# EAGLE design main (EAGLE 7.2.0)
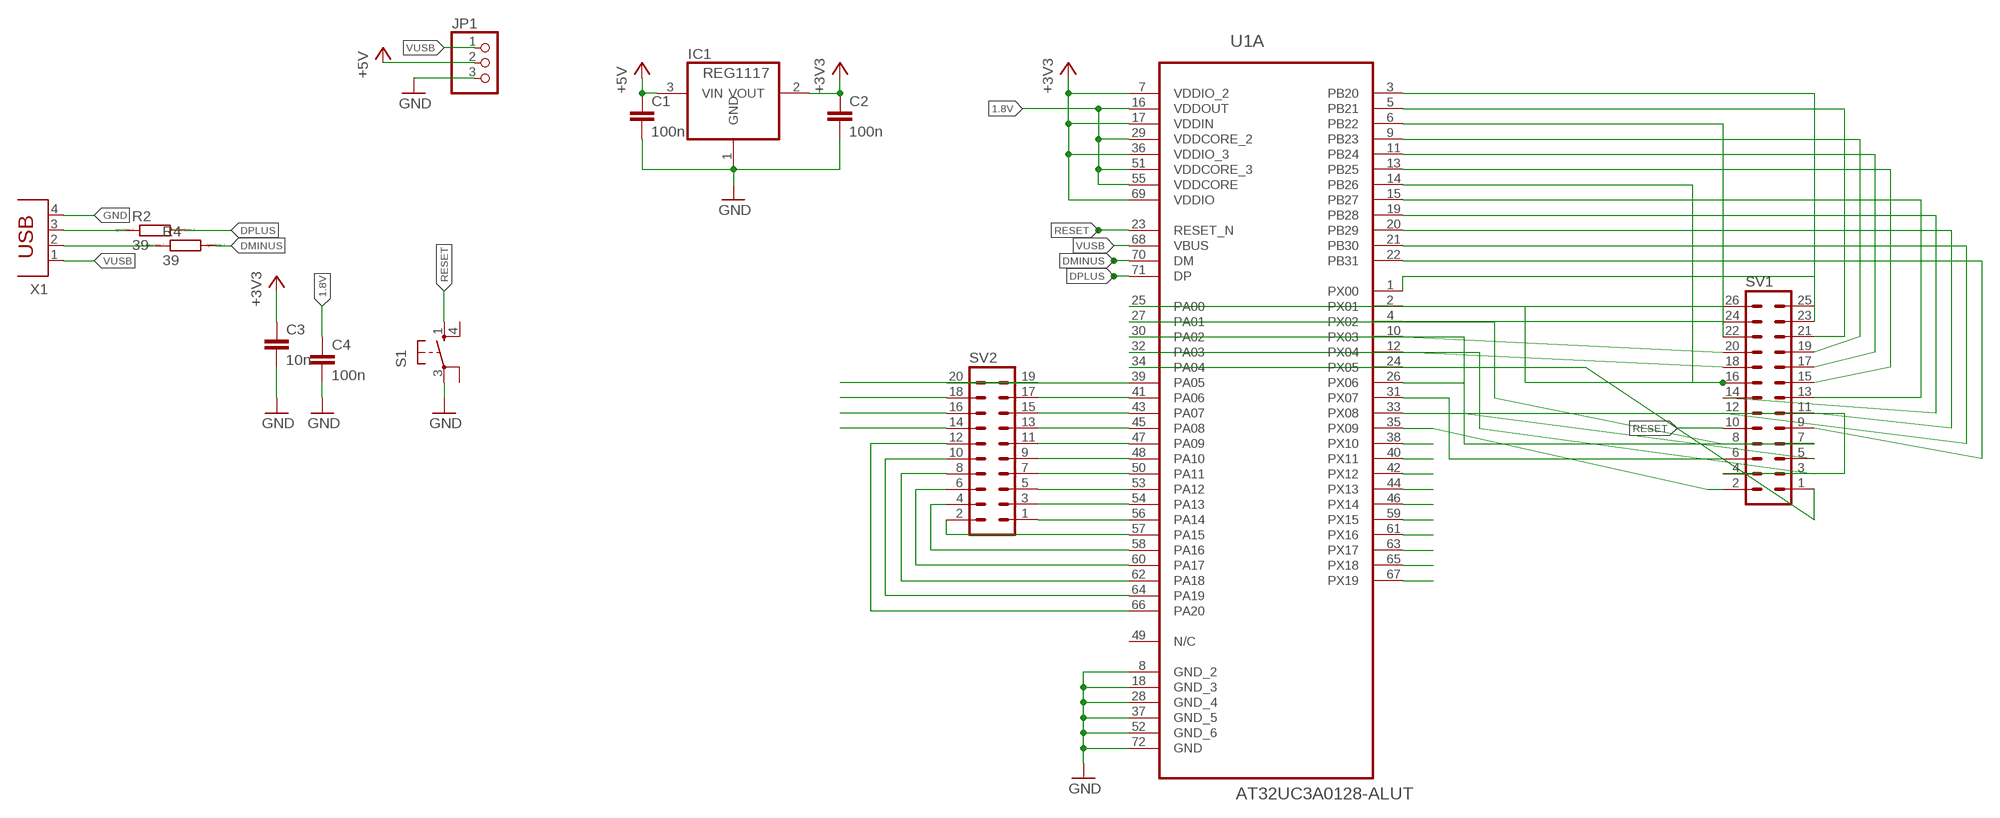
[diagram p0: schematic, sheet 1]

## Parts
C1  100n  C-EU050-025X075  [C050-025X075]
C2  100n  C-EU050-025X075  [C050-025X075]
C3  10n  C-EU050-025X075  [C050-025X075]
C4  100n  C-EU050-025X075  [C050-025X075]
IC1  REG1117  [SOT223]
JP1  PINHD-1X3  [1X03]
R2  39  R0207/10  [0207/10]
R4  39  R0207/10  [0207/10]
S1  10-XX  [B3F-10XX]
SV1  MA13-2  [MA13-2]
SV2  MA10-2  [MA10-2]
U1  AT32UC3A0128-ALUT  [QFP50P2200X2200X160-144N]
X1  PN61729  [PN61729]

## Nets
1.8V: C4.1 U1.16(A:VDDOUT) U1.29(A:VDDCORE_2) U1.51(A:VDDCORE_3) U1.55(A:VDDCORE)
+3V3: C2.1 C3.1 IC1.2(VOUT) U1.7(A:VDDIO_2) U1.17(A:VDDIN) U1.36(A:VDDIO_3) U1.69(A:VDDIO)
+5V: C1.1 IC1.3(VIN) JP1.2
B$1: SV2.14 SV2.16 SV2.18 SV2.19 U1.38(A:PX10) U1.40(A:PX11) U1.42(A:PX12) U1.44(A:PX13) U1.46(A:PX14) U1.59(A:PX15) U1.61(A:PX16) U1.63(A:PX17) U1.65(A:PX18) U1.67(A:PX19)
DMINUS: R4.2 U1.70(A:DM)
DPLUS: R2.2 U1.71(A:DP)
GND: C1.2 C2.2 C3.2 C4.2 IC1.1(GND) JP1.3 S1.3(P) U1.8(A:GND_2) U1.18(A:GND_3) U1.28(A:GND_4) U1.37(A:GND_5) U1.52(A:GND_6) U1.72(A:GND) X1.4
N$1: SV1.25 U1.1(A:PX00)
N$2: SV1.26 U1.2(A:PX01)
N$3: SV1.23 U1.3(A:PB20)
N$4: SV1.21 U1.5(A:PB21)
N$5: SV1.24 U1.4(A:PX02)
N$6: SV1.20 U1.10(A:PX03)
N$7: SV1.22 U1.6(A:PB22)
N$8: SV1.19 U1.9(A:PB23)
N$9: SV1.17 U1.11(A:PB24)
N$10: SV1.18 U1.12(A:PX04)
N$11: SV1.15 U1.13(A:PB25)
N$12: SV1.16 U1.14(A:PB26) U1.25(A:PA00)
N$13: SV1.13 U1.15(A:PB27)
N$14: SV1.14 U1.19(A:PB28)
N$15: SV1.11 U1.20(A:PB29)
N$16: SV1.12 U1.21(A:PB30)
N$17: SV1.9 U1.22(A:PB31)
N$18: SV1.7 U1.26(A:PX06)
N$19: SV1.8 U1.27(A:PA01)
N$20: SV1.5 U1.30(A:PA02)
N$21: SV1.3 U1.32(A:PA03)
N$22: SV1.1 U1.34(A:PA04)
N$23: SV1.6 U1.31(A:PX07)
N$24: SV1.4 U1.33(A:PX08)
N$25: SV1.2 U1.35(A:PX09)
N$26: R2.1 X1.3
N$27: SV2.12 U1.66(A:PA20)
N$28: R4.1 X1.2
N$29: SV2.10 U1.64(A:PA19)
N$30: SV2.8 U1.62(A:PA18)
N$31: SV2.6 U1.60(A:PA17)
N$32: SV2.4 U1.58(A:PA16)
N$33: SV2.2 U1.57(A:PA15)
N$34: SV2.1 U1.56(A:PA14)
N$35: SV2.3 U1.54(A:PA13)
N$36: SV2.5 U1.53(A:PA12)
N$37: SV2.7 U1.50(A:PA11)
N$38: SV2.9 U1.48(A:PA10)
N$39: SV2.11 U1.47(A:PA09)
N$40: SV2.13 U1.45(A:PA08)
N$41: SV2.15 U1.43(A:PA07)
N$42: SV2.17 U1.41(A:PA06)
N$43: SV2.20 U1.39(A:PA05)
RESET: S1.1(S) SV1.10 U1.23(A:RESET_N)
VUSB: JP1.1 U1.68(A:VBUS) X1.1
Unconnected: S1.2(P1) S1.4(S1) U1.24(A:PX05) U1.49(A:N/C) U1.73(B:PA21) U1.74(B:PA22) U1.75(B:PA23) U1.76(B:PA24) U1.77(B:PA25) U1.78(B:PA26) U1.79(B:PA27) U1.80(B:PA28) U1.82(B:ADVREF) U1.83(B:GNDANA) U1.85(B:PC00) U1.86(B:PC01) U1.87(B:PX20) U1.88(B:PB00) U1.89(B:PX21) U1.90(B:PB01) U1.91(B:PX22) U1.94(B:GND_2) U1.95(B:PX23) U1.96(B:PB02) U1.97(B:PX24) U1.98(B:PB03) U1.99(B:PX25) U1.100(B:PB04) U1.101(B:PX26) U1.102(B:PB05) U1.103(B:PX27) U1.104(B:PB06) U1.105(B:PX28) U1.106(B:PB07) U1.107(B:PX29) U1.109(B:GND_3) U1.110(B:PX30) U1.111(B:PB08) U1.112(B:PX31) U1.113(B:PB09) U1.114(B:PX32) U1.115(B:PB10) U1.117(B:GND) U1.118(B:PX33) U1.119(B:PB11) U1.120(B:PX34) U1.121(B:PB12) U1.122(B:PA29) U1.123(B:PA30) U1.124(B:PC02) U1.125(B:PC03) U1.126(B:PB13) U1.127(B:PB14) U1.128(B:TMS) U1.129(B:TCK) U1.130(B:TDO) U1.131(B:TDI) U1.132(B:PC04) U1.133(B:PC05) U1.134(B:PB15) U1.135(B:PX35) U1.136(B:PB16) U1.137(B:PX36) U1.139(B:PB17) U1.140(B:PX37) U1.141(B:PB18) U1.142(B:PX38) U1.143(B:PB19) U1.144(B:PX39)

## Power pins joined to a net without a drawn wire
VDDANA: U1.81(B:VDDANA)
VDDCORE: U1.138(B:VDDCORE)
VDDIO: U1.116(B:VDDIO)
VDDIO_2: U1.92(B:VDDIO_2)
VDDIO_3: U1.93(B:VDDIO_3)
VDDIO_4: U1.108(B:VDDIO_4)
VDDPLL: U1.84(B:VDDPLL)

## Library data of the parts
C1-C4 = rcl:C-EU: CAPACITOR, European symbol
IC1 = burr-brown:REG1117: 800mA and 1A Low Dropout (LDO) Positive Regulator 1.8V, 2.5V, 2.85V, 3.3V, 5V, and Adj; MPN: REG1117; OC_FARNELL: 1097566; OC_NEWARK: 14P6981
JP1 = pinhead:PINHD-1X3: PIN HEADER
R2 R4 = eagle-ltspice:R: RESISTOR, European symbol; SPICEMODEL: NONE; SPICEPREFIX: R
S1 = switch-omron:10-XX: OMRON SWITCH; MPN: B3F-1000; OC_FARNELL: 176432; OC_NEWARK: 36M3542
SV1 = con-lstb:MA13-2: PIN HEADER; OC_FARNELL: unknown; OC_NEWARK: unknown
SV2 = con-lstb:MA10-2: PIN HEADER; OC_FARNELL: unknown; OC_NEWARK: unknown
U1 = Atmel_By_element14_Batch_1-00:AT32UC3A0128-ALUT: 32-Bit Microcontroller; DESCRIPTION: 32-Bit Microcontroller; MPN: AT32UC3A0128-ALUT; OC_FARNELL: 1841633; OC_NEWARK: 12T1368; PACKAGE: LQFP-144; SUPPLIER: Atmel Corporation
X1 = con-berg:PN61729: BERG USB connector; OC_FARNELL: unknown; OC_NEWARK: unknown

## Board
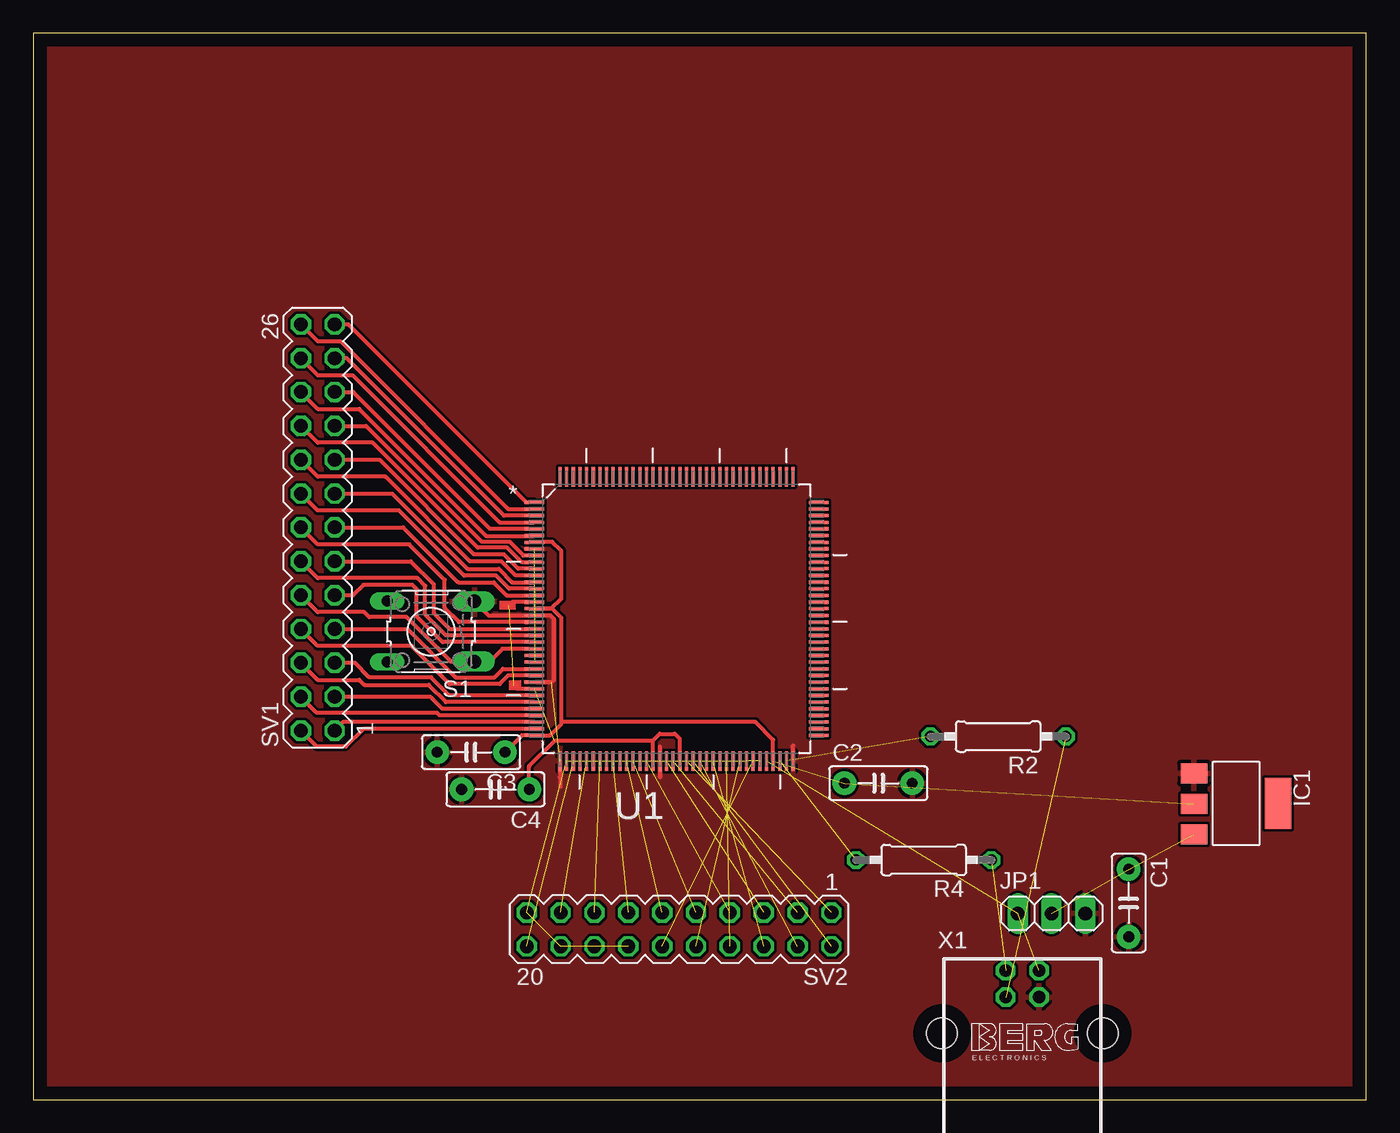
[diagram p1: board, top side]

Size 100 x 80 mm. Coordinates in mm from the lower left corner, seen from the top.
Outline: 0,0 100,0 100,80 0,80 0,0
Copper layers (1*16): Top 0.035mm / dielectric 1.5mm / Bottom 0.035mm
Design rules "default": minimum track width 10mil, minimum drill 24mil, track to track 8mil, track to pad 8mil, pad to pad 8mil, via to via 8mil, smd to smd 8mil, copper to edge 40mil, drill to drill 8mil, minimum pad ring 10mil, minimum via ring 8mil, stop-mask expansion 4mil, vias tented up to drill 0mil, thermal gap 10mil

### Footprints (pad centres in the part's own frame; a part is rotated, then mirrored left to right if it is on the bottom)
C050-025X075 = drill 0.813 pad 1.778: 1 -2.54,0; 2 2.54,0
SOT223 = smd 1.499 x 2.007: 1 -2.261,-3.15; 2 0.025,-3.15; 3 2.311,-3.15 | smd 3.81 x 2.007: 4 0,3.15
1X03 = drill 1.016 long: 1 -2.54,0; 2 0,0; 3 2.54,0
0207/10 = drill 0.813 octagon: 1 -5.08,0; 2 5.08,0
B3F-10XX = drill 1.016 long: 1 -3.251,2.261; 3 -3.251,-2.261 | drill 0.8 pad 0.254 long: 2 3.302,2.286; 4 3.302,-2.286
MA13-2 = drill 1.016 octagon: 1 -15.24,-1.27; 2 -15.24,1.27; 3 -12.7,-1.27; 4 -12.7,1.27; 5 -10.16,-1.27; 6 -10.16,1.27; 7 -7.62,-1.27; 8 -7.62,1.27; 9 -5.08,-1.27; 10 -5.08,1.27; 11 -2.54,-1.27; 12 -2.54,1.27; 13 0,-1.27; 14 0,1.27; 15 2.54,-1.27; 16 2.54,1.27; 17 5.08,-1.27; 18 5.08,1.27; 19 7.62,-1.27; 20 7.62,1.27; 21 10.16,-1.27; 22 10.16,1.27; 23 12.7,-1.27; 24 12.7,1.27; 25 15.24,-1.27; 26 15.24,1.27
MA10-2 = drill 1.016 octagon: 1 -11.43,-1.27; 2 -11.43,1.27; 3 -8.89,-1.27; 4 -8.89,1.27; 5 -6.35,-1.27; 6 -6.35,1.27; 7 -3.81,-1.27; 8 -3.81,1.27; 9 -1.27,-1.27; 10 -1.27,1.27; 11 1.27,-1.27; 12 1.27,1.27; 13 3.81,-1.27; 14 3.81,1.27; 15 6.35,-1.27; 16 6.35,1.27; 17 8.89,-1.27; 18 8.89,1.27; 19 11.43,-1.27; 20 11.43,1.27
QFP50P2200X2200X160-144N = smd 1.473 x 0.229: 1 -10.668,8.738; 2 -10.668,8.255; 3 -10.668,7.747; 4 -10.668,7.239; 5 -10.668,6.756; 6 -10.668,6.248; 7 -10.668,5.74; 8 -10.668,5.258; 9 -10.668,4.75; 10 -10.668,4.242; 11 -10.668,3.759; 12 -10.668,3.251; 13 -10.668,2.743; 14 -10.668,2.261; 15 -10.668,1.753; 16 -10.668,1.245; 17 -10.668,0.762; 18 -10.668,0.254; 19 -10.668,-0.254; 20 -10.668,-0.762; 21 -10.668,-1.245; 22 -10.668,-1.753; 23 -10.668,-2.261; 24 -10.668,-2.743; 25 -10.668,-3.251; 26 -10.668,-3.759; 27 -10.668,-4.242; 28 -10.668,-4.75; 29 -10.668,-5.258; 30 -10.668,-5.74; 31 -10.668,-6.248; 32 -10.668,-6.756; 33 -10.668,-7.239; 34 -10.668,-7.747; 35 -10.668,-8.255; 36 -10.668,-8.738; 73 10.668,-8.738; 74 10.668,-8.255; 75 10.668,-7.747; 76 10.668,-7.239; 77 10.668,-6.756; 78 10.668,-6.248; 79 10.668,-5.74; 80 10.668,-5.258; 81 10.668,-4.75; 82 10.668,-4.242; 83 10.668,-3.759; 84 10.668,-3.251; 85 10.668,-2.743; 86 10.668,-2.261; 87 10.668,-1.753; 88 10.668,-1.245; 89 10.668,-0.762; 90 10.668,-0.254; 91 10.668,0.254; 92 10.668,0.762; 93 10.668,1.245; 94 10.668,1.753; 95 10.668,2.261; 96 10.668,2.743; 97 10.668,3.251; 98 10.668,3.759; 99 10.668,4.242; 100 10.668,4.75; 101 10.668,5.258; 102 10.668,5.74; 103 10.668,6.248; 104 10.668,6.756; 105 10.668,7.239; 106 10.668,7.747; 107 10.668,8.255; 108 10.668,8.738 | smd 0.229 x 1.473: 37 -8.738,-10.668; 38 -8.255,-10.668; 39 -7.747,-10.668; 40 -7.239,-10.668; 41 -6.756,-10.668; 42 -6.248,-10.668; 43 -5.74,-10.668; 44 -5.258,-10.668; 45 -4.75,-10.668; 46 -4.242,-10.668; 47 -3.759,-10.668; 48 -3.251,-10.668; 49 -2.743,-10.668; 50 -2.261,-10.668; 51 -1.753,-10.668; 52 -1.245,-10.668; 53 -0.762,-10.668; 54 -0.254,-10.668; 55 0.254,-10.668; 56 0.762,-10.668; 57 1.245,-10.668; 58 1.753,-10.668; 59 2.261,-10.668; 60 2.743,-10.668; 61 3.251,-10.668; 62 3.759,-10.668; 63 4.242,-10.668; 64 4.75,-10.668; 65 5.258,-10.668; 66 5.74,-10.668; 67 6.248,-10.668; 68 6.756,-10.668; 69 7.239,-10.668; 70 7.747,-10.668; 71 8.255,-10.668; 72 8.738,-10.668; 109 8.738,10.668; 110 8.255,10.668; 111 7.747,10.668; 112 7.239,10.668; 113 6.756,10.668; 114 6.248,10.668; 115 5.74,10.668; 116 5.258,10.668; 117 4.75,10.668; 118 4.242,10.668; 119 3.759,10.668; 120 3.251,10.668; 121 2.743,10.668; 122 2.261,10.668; 123 1.753,10.668; 124 1.245,10.668; 125 0.762,10.668; 126 0.254,10.668; 127 -0.254,10.668; 128 -0.762,10.668; 129 -1.245,10.668; 130 -1.753,10.668; 131 -2.261,10.668; 132 -2.743,10.668; 133 -3.251,10.668; 134 -3.759,10.668; 135 -4.242,10.668; 136 -4.75,10.668; 137 -5.258,10.668; 138 -5.74,10.668; 139 -6.248,10.668; 140 -6.756,10.668; 141 -7.239,10.668; 142 -7.747,10.668; 143 -8.255,10.668; 144 -8.738,10.668
PN61729 = drill 0.95 octagon: 1 1.25,4.71; 2 -1.25,4.71; 3 -1.25,2.71; 4 1.25,2.71 | hole 2.3: -6.02,0; 6.02,0

### Placement (x,y rotation side)
C1  82.18,14.74 270 top
C2  63.4,23.74 0 top
C3  32.84,26.06 180 top
C4  34.67,23.27 180 top
IC1  90.23,22.21 270 top
JP1  76.39,13.96 0 top
R2  72.39,27.24 180 top
R4  66.8,17.97 180 top
S1  29.84,35.12 180 top
SV1  21.34,42.93 90 top
SV2  48.45,12.76 180 top
U1  48.26,36.07 0 top
X1  74.21,4.97 0 top

### Tracks (layer width: path | path; a pad name or v marks a point on that pad's centre or on a via)
1.8V  (2 unrouted)
  Top 0.305: U1.51 46.51,26.95 | U1.55 48.51,27.05 48.13,27.43 46.99,27.43 46.51,26.95 | U1.16 35.92,37.31 35.69,37.08 | U1.29 36.31,30.81 36.07,31.05 | 46.51,26.95 46.48,26.92 39.12,26.92 37.21,25.02 C4.1
+3V3  (2 unrouted)
  Top 0.305: U1.69 55.5,26.99 54.17,28.32 39.62,28.32 | U1.7 37.63,41.85 38.92,41.85 39.62,41.15 39.62,37.59 38.86,36.83 U1.17 38.92,36.83 39.62,36.13 39.62,28.32 | 39.62,28.32 39.62,28.19 38.76,27.33 U1.36 36.65,27.33 C3.1
+5V  (2 unrouted)
B$1  (13 unrouted)
DMINUS  (1 unrouted)
DPLUS  (1 unrouted)
GND  (2 unrouted)
  Top 0.305: 39.52,23.47 U1.37 39.52,24.22 39.5,24.19 | 47.02,26.49 U1.52 47.02,24.23 47.05,24.19 | U1.72 57,26.57 | U1.28 38.88,31.32 39.05,31.5 39.05,36.07 38.8,36.32 U1.18 34.15,36.32 S1.3
  pour Top: 0,80.01 100.33,80.01 100.33,0 0,0
N$1
  Top 0.305: U1.1 37.57,44.83 36.96,44.83 23.62,58.17 SV1.25
N$2
  Top 0.305: U1.2 35.62,44.32 23.05,56.9 21.34,56.9 SV1.26
N$3
  Top 0.305: U1.3 35.31,43.81 23.5,55.63 SV1.23
N$4
  Top 0.305: U1.5 34.27,42.82 24,53.09 SV1.21
N$5
  Top 0.305: U1.4 34.99,43.31 23.94,54.36 21.34,54.36 SV1.24
N$6
  Top 0.305: U1.10 36.65,40.31 35.56,41.4 33.34,41.4 25.46,49.28 21.34,49.28 SV1.20
N$7
  Top 0.305: U1.6 37.57,42.29 33.97,42.29 24.45,51.82 21.34,51.82 SV1.22
N$8
  Top 0.305: U1.9 36.78,40.82 35.75,41.85 33.66,41.85 24.96,50.55 SV1.19
N$9
  Top 0.305: U1.11 36.37,39.83 35.31,40.89 33.08,40.89 25.97,48.01 SV1.17
N$10
  Top 0.305: U1.12 36.18,39.32 35.12,40.39 32.77,40.39 26.42,46.74 21.34,46.74 SV1.18
N$11
  Top 0.305: U1.13 35.93,38.81 34.92,39.81 32.58,39.81 26.92,45.47 SV1.15
N$12  (1 unrouted)
  Top 0.305: U1.14 35.71,38.33 34.73,39.31 32.32,39.31 27.43,44.2 21.34,44.2 SV1.16 | 37.6,32.83 U1.25
N$13
  Top 0.305: U1.15 35.52,37.82 34.54,38.8 31.88,38.8 27.75,42.93 SV1.13
N$14
  Top 0.305: U1.19 31.94,35.81 30.86,36.89 30.86,38.99 28.19,41.66 21.34,41.66 SV1.14
N$15
  Top 0.305: U1.20 31.24,35.31 30.04,36.51 30.04,38.67 28.32,40.39 SV1.11
N$16
  Top 0.305: U1.21 30.96,34.82 29.4,36.39 29.4,38.54 28.83,39.12 21.34,39.12 SV1.12
N$17
  Top 0.305: U1.22 30.71,34.31 28.77,36.26 28.77,38.29 28.45,38.61 24.77,38.61 24,37.85 SV1.9
N$18
  Top 0.305: SV1.7 28.07,35.31 31.69,31.69 34.61,31.69 35.24,32.32 37.58,32.32 U1.26
N$19
  Top 0.305: U1.27 35.64,31.83 34.99,31.18 31.24,31.18 28.38,34.04 21.34,34.04 SV1.8
N$20
  Top 0.305: U1.30 31.2,30.33 29.84,31.69 25.21,31.69 24.13,32.77 SV1.5
N$21
  Top 0.305: SV1.3 29.78,30.23 30.7,29.31 U1.32
N$22
  Top 0.305: U1.34 23.24,28.32 SV1.1
N$23
  Top 0.305: SV1.6 21.34,31.5 24.45,31.5 24.83,31.11 29.67,31.11 30.96,29.82 U1.31
N$24
  Top 0.305: U1.33 30.48,28.83 30.29,29.02 21.27,29.02 SV1.4
N$25
  Top 0.305: U1.35 24.77,27.81 23.43,26.48 21.27,26.48 SV1.2
N$26  (1 unrouted)
N$27  (1 unrouted)
N$28  (1 unrouted)
N$29  (1 unrouted)
N$30  (1 unrouted)
N$31  (1 unrouted)
N$32  (1 unrouted)
N$33  (1 unrouted)
N$34  (1 unrouted)
N$35  (1 unrouted)
N$36  (1 unrouted)
N$37  (1 unrouted)
N$38  (1 unrouted)
N$39  (1 unrouted)
N$40  (1 unrouted)
N$41  (1 unrouted)
N$42  (1 unrouted)
N$43  (1 unrouted)
RESET
  Top 0.305: U1.23 35.2,33.81 34.23,32.83 33.12,32.83 S1.1 31.34,32.85 28,36.2 25.21,36.2 24.83,36.58 21.34,36.58 SV1.10
VUSB  (2 unrouted)
(copper drawn outside any net)
  shapes: Top area x2